# Altium schematic sheet NNP-DWG-165-001-000 BP2 Analog-Digital Peripheral System Pg 5 of 6.SchDoc
size 431 x 279 mm; Organization: ORGANIZATION; Address1: ADDRESS 1; Address2: ADDRESS 2; Address3: ADDRESS 3; Address4: ADDRESS 4; Revision: -; SheetNumber: 1; SheetTotal: 6; ENG_APP_DATE: --/--/--; DSN_APP_DATE: --/--/--; CHK_APP_DATE: --/--/--
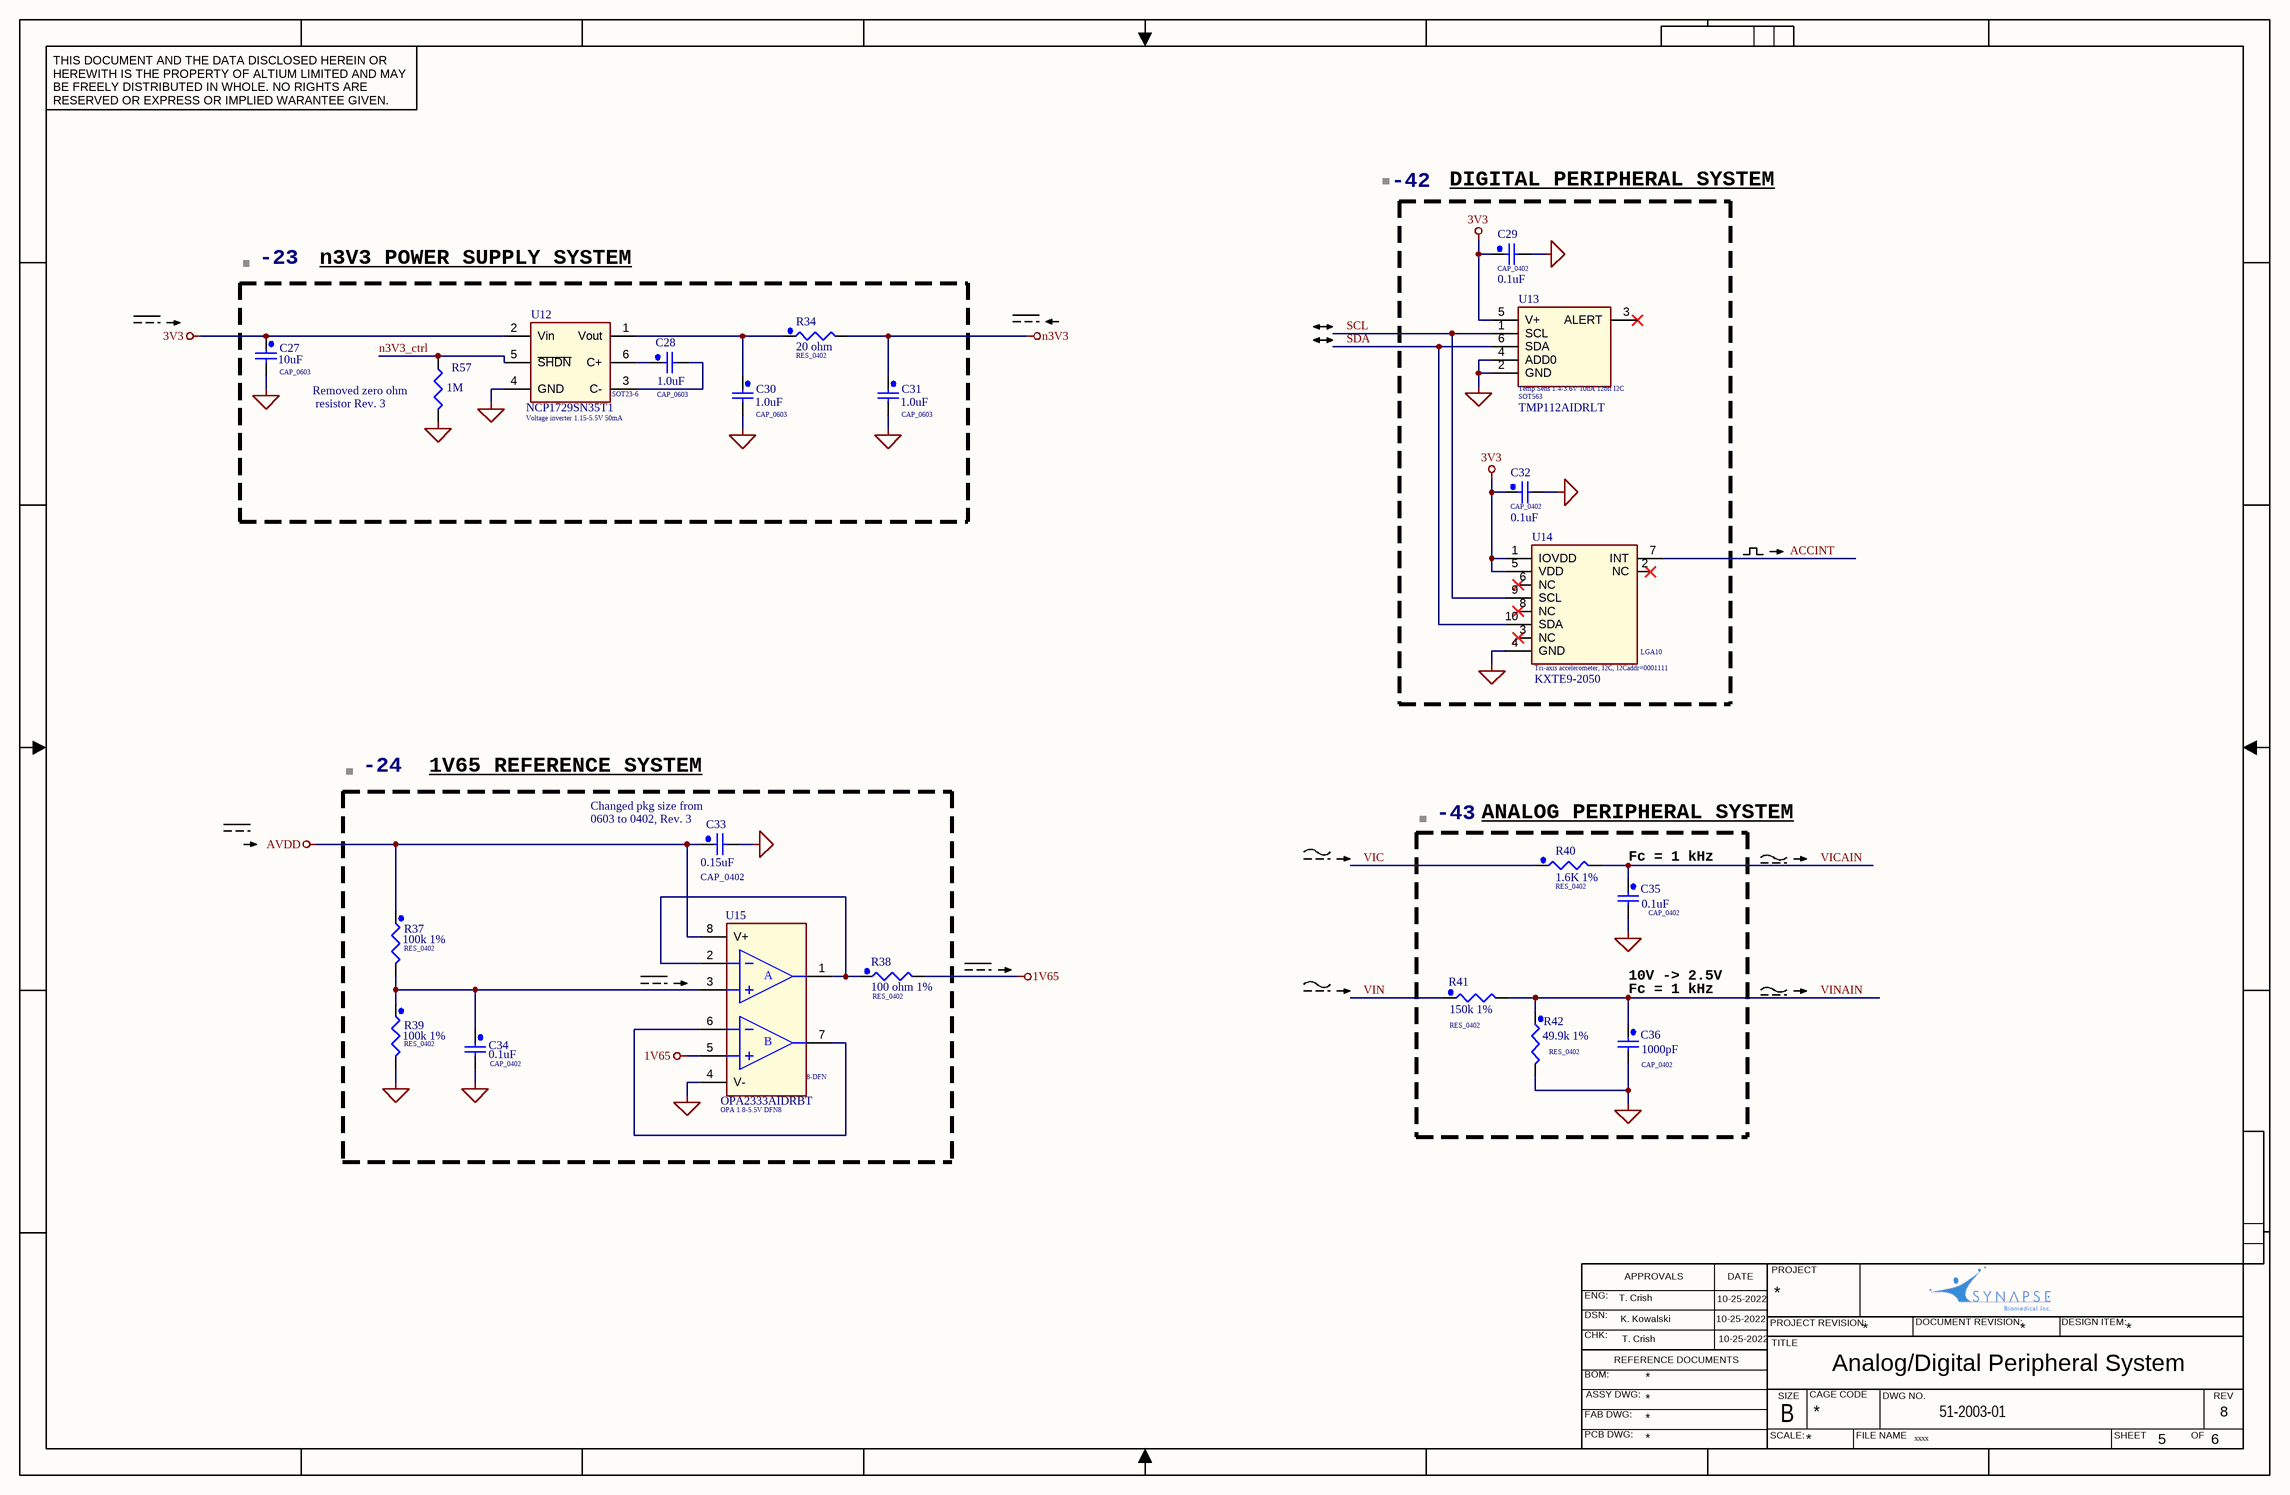
[diagram p0: NNP-DWG-165-001-000 BP2 Analog-Digital Peripheral System Pg 5 of 6.SchDoc]

## Parts
-23  XDESCRIPTION: n3V3 POWER SUPPLY SYSTEM  (hidden comment: BOM_S1)  (graphical)
-24  XDESCRIPTION: 1V65 REFERENCE SYSTEM  (hidden comment: BOM_S1)  (graphical)
-42  XDESCRIPTION: DIGITAL PERIPHERAL SYSTEM  (hidden comment: BOM_S1)  (graphical)
-43  XDESCRIPTION: ANALOG PERIPHERAL SYSTEM  (hidden comment: BOM_S1)  (graphical)
C27  value 10uF  [CAP_0603]  (hidden comment: C_10u_X5R_6V3_0603_20%)
C28  value 1.0uF  [CAP_0603]  (hidden comment: C_1u_X7R_25_0603_10%)
C29  value 0.1uF  [CAP_0402]  (hidden comment: C_100n_X7R_16_0402_10%)
C30  value 1.0uF  [CAP_0603]  (hidden comment: C_1u_X7R_25_0603_10%)
C31  value 1.0uF  [CAP_0603]  (hidden comment: C_1u_X7R_25_0603_10%)
C32  value 0.1uF  [CAP_0402]  (hidden comment: C_100n_X7R_16_0402_10%)
C33  value 0.15uF  [CAP_0402]  (hidden comment: C_150n_X7R_16_0402_10%)
C34  value 0.1uF  [CAP_0402]  (hidden comment: C_100n_X7R_16_0402_10%)
C35  value 0.1uF  [CAP_0402]  (hidden comment: C_100n_X7R_16_0402_10%)
C36  value 1000pF  [CAP_0402]  (hidden comment: C_1n_C0G_50_0402_5%)
R34  value 20 ohm  [RES_0402]  (hidden comment: R_20_0402)
R37  value 100k 1%  [RES_0402]  (hidden comment: R_100k_0402)
R38  value 100 ohm 1%  [RES_0402]  (hidden comment: R_100_0402)
R39  value 100k 1%  [RES_0402]  (hidden comment: R_100k_0402)
R40  value 1.6K 1%  [RES_0402]  (hidden comment: R_1k6_0402)
R41  value 150k 1%  [RES_0402]  (hidden comment: R_150k_0402)
R42  value 49.9k 1%  [RES_0402]  (hidden comment: R_49k9_0402)
R57  value 1M  [CHIP_0402N]  (hidden comment: 1M 0402 Resistor)
U12  Voltage inverter 1.15-5.5V 50mA  [SOT23-6]
U13  Temp Sens 1.4-3.6V 10uA 12bit I2C  PackageDescription: SOT563  [SOT-563]
U14  Tri-axis accelerometer, I2C, I2Caddr=0001111  [LGA10]
U15  OPA 1.8-5.5V DFN8  PackageDescription: 8-DFN  [TI-DRB8-2400X1650TP_V]

## Nets
1V65: R38.2 U15.5(+IN_B)
3V3: C27.1 C29.1 C32.1 U12.2(Vin) U13.5(V+) U14.1(IOVDD) U14.5(VDD)
AVDD: C33.1 R37.1 U15.8(V+)
GND: C27.2 C29.2 C30.2 C31.2 C32.2 C33.2 C34.2 C35.2 C36.2 R39.2 R42.2 R57.2 U12.4(GND) U13.2(GND) U13.4(ADD0) U14.4(GND) U15.4(V-)
n3V3: C31.1 R34.2
ACCINT: U14.7(INT)
n3V3_ctrl: R57.1 U12.5(~{SHDN})
SCL: U13.1(SCL) U14.9(SCL)
SDA: U13.6(SDA) U14.10(SDA)
VIC: R40.1
VICAIN: C35.1 R40.2
VIN: R41.1
VINAIN: C36.1 R41.2 R42.1
NetC28_1: C28.1 U12.6(C+)
NetC28_2: C28.2 U12.3(C-)
NetC30_1: C30.1 R34.1 U12.1(Vout)
NetC34_1: C34.1 R37.2 R39.1 U15.3(+IN_A)
NetR38_1: R38.1 U15.1(OUT_A) U15.2(-IN_A)
NetU15_6: U15.6(-IN_B) U15.7(OUT_B)

Not connected (* = marked no-connect by the designer): U13 3(ALERT)*; U14 2(NC)* 3(NC)* 6(NC)* 8(NC)*

## Notes on the sheet
- THIS DOCUMENT AND THE DATA DISCLOSED HEREIN OR HEREWITH IS THE PROPERTY OF ALTIUM LIMITED AND MAY BE FREELY DISTRIBUTED IN WHOLE. NO RIGHTS ARE RESERVED OR EXPRESS OR IMPLIED WARANTEE GIVEN.
- (near R57) Removed zero ohm
  resistor Rev. 3
- (near C33) Changed pkg size from
  0603 to 0402, Rev. 3
- Fc = 1 kHz
- (near C36) Fc = 1 kHz
- 10V -> 2.5V
- ENG:
- T. Crish
- APPROVALS
- 10-25-2022
- DATE
- PROJECT
- DSN:
- CHK:
- REFERENCE DOCUMENTS
- K. Kowalski
- PROJECT REVISION:
- TITLE
- *
- DOCUMENT REVISION:
- Analog/Digital Peripheral System
- DESIGN ITEM:
- BOM:
- FAB DWG:
- PCB DWG:
- ASSY DWG:
- SCALE:
- SIZE
- B
- CAGE CODE
- FILE NAME
- DWG NO.
- 51-2003-01
- SHEET
- OF
- REV
- 8
- xxxx
- 5
- 6
- (in symbol OPA2333AIDRBT) A; B

## Library data of the parts
-23 -24 -42 -43 = BOM_S1: BOM item small graphic
C27 = ECJ-1VB0J106M: 10uF, 6.3V, X5R, 0603_20%, RoHS; MFR: Murata Electronics North America; SBI: 53-0039; PackageDescription: CAP_0603; Supplier 1: Digi-Key; Supplier Part Number 1: 490-6405-6-ND; MPN: GRM188R60J106ME47J
C28 C30 C31 = ECJ-1VB0J106M: 1.0uF, 25V, X7R, 0603, 10%, RoHs; MFR: TDK Corp; MPN: CGA3E1X7R1C105K080AC; SBI: 53-0067; PackageDescription: CAP_0603; Supplier 1: Digi-Key; Supplier Part Number 1: 445-12539
C29 C32 C34 C35 = GRM155R71C104KA88D: 0.1uF, 16V, X7R, 0402, RoHS; MFR: Murata Electronics North America; SBI: 53-0040; PackageDescription: CAP_0402; Supplier 1: Digi-Key; Supplier Part Number 1: 490-3261-6-ND; MPN: GRM155R71C104KA88D
C33 = GRM188R71C154KA01D: 0.15uF, 16V, X7R, 10%, 0402, RoHS; MFR: Murata Electronics North America; SBI: 53-0040-2; Note: GRM155R71C154KA12D; PackageDescription: CAP_0402; Supplier 1: Digi-Key; Supplier Part Number 1: 490-5955-6-ND; MPN: GRM155R71C154KA12D
C36 = GRM1555C1H102JA01D: 1000pF, 50V, C0G, 5%, 0402, RoHS; MFR: Murata Electronics North America; SBI: 53-0041-2; PackageDescription: CAP_0402; Supplier 1: Digi-Key; Supplier Part Number 1: 490-3244-6-ND; MPN: GRM1555C1H102JA01D
R34 = CRCW040220R0FKED: 20 ohm, 1%, 0402, 1%, RoHS; MFR: Vishay; SBI: 53-0049-17; PackageDescription: RES_0402; Supplier 1: Digi-Key; Supplier Part Number 1: 541-20.0LCT-ND; MPN: CRCW040220R0FKED
R37 R39 = MCR01MZPF1003: 100k ohm, 1%, 1/16W, smd, 0402, RoHS; MFR: Vishay Dale; SBI: 53-0049-7; PackageDescription: RES_0402; Supplier 1: Digi-Key; Supplier Part Number 1: 541-100KLCT-ND; MPN: CRCW0402100KFKED
R38 = MCR01MZPF1000: 100 ohm, 1%, 1/16W, 0402, RoHS; MFR: Vishay Dale; SBI: 53-0049-18; PackageDescription: RES_0402; Supplier 1: Digi-Key; Supplier Part Number 1: 541-100LCT-ND; MPN: CRCW0402100RFKED
R40 = CRCW04021K60FKED: 1.6K ohm, 1%, 1/16W, smd, 0402, RoHS; MFR: Vishay Dale; SBI: 53-0049-10; PackageDescription: RES_0402; Supplier 1: Digi-Key; Supplier Part Number 1: 541-1.60KLCT-ND; MPN: CRCW04021K60FKED
R41 = MCR01MZPF1503: 150k ohm, 1%, 1/16W, smd, 0402, RoHS; MFR: Vishay Dale; SBI: 53-0049-11; PackageDescription: RES_0402; Supplier 1: Digi-Key; Supplier Part Number 1: 541-150KLCT-Nd; MPN: CRCW0402150KFKED
R42 = MCR01MZPF4992: 49.9k ohm, 1%, 1/16W, 0402, RoHS; MFR: Vishay Dale; MPN: CRCW040249K9FKED; SBI: 53-0049-2; PackageDescription: RES_0402; Supplier 1: Digi-Key; Supplier Part Number 1: 541-49.9KLCT-ND
R57 = R_1M_0402: Resistor 1M 0402 1% 63mW; Manufacturer: Rohm; ManufacturerPN: MCR01MZPF1004; Supplier 1: Digi-Key; Supplier Part Number 1: RHM1.00MLCT-ND
U12 = NCP1729SN35T1: Voltage inverter, 1.15-5.5V, 50mA, SOT23-6, RoHS; MFR: ON Semiconductor; SBI: 54-0079; PackageDescription: SOT23-6; MPN: NCP1729SN35T1; Supplier 1: Digi-Key; Supplier Part Number 1: NCP1729SN35T1GOSTR-ND
U13 = TMP112AIDRLT: Temperature Sensor,12bit I2C,  SOT563, RoHS; MFR: Texas Instruments; SBI: 54-0062; Supplier 1: Digi-Key; Supplier Part Number 1: 296-24621-1-ND; MPN: TMP112AIDRLT
U14 = KXTE9-2050: Tri-axis accelerometer, I2C,  LGA10, RoHS; MFR: Kionix; SBI: 54-0074; PackageDescription: LGA10; MPN: KXTE9-2050; Supplier 1: Mouser; Supplier Part Number 1: 912-KXTE9-2050
U15 = OPA2333AIDRBT: OPA, 1.8-5.5V, DFN8, RoHS; MFR: Texas Instruments; SBI: 54-0080; Supplier 1: Digi-Key; Supplier Part Number 1: 296-19544-1-ND; MPN: OPA2333AIDRBT